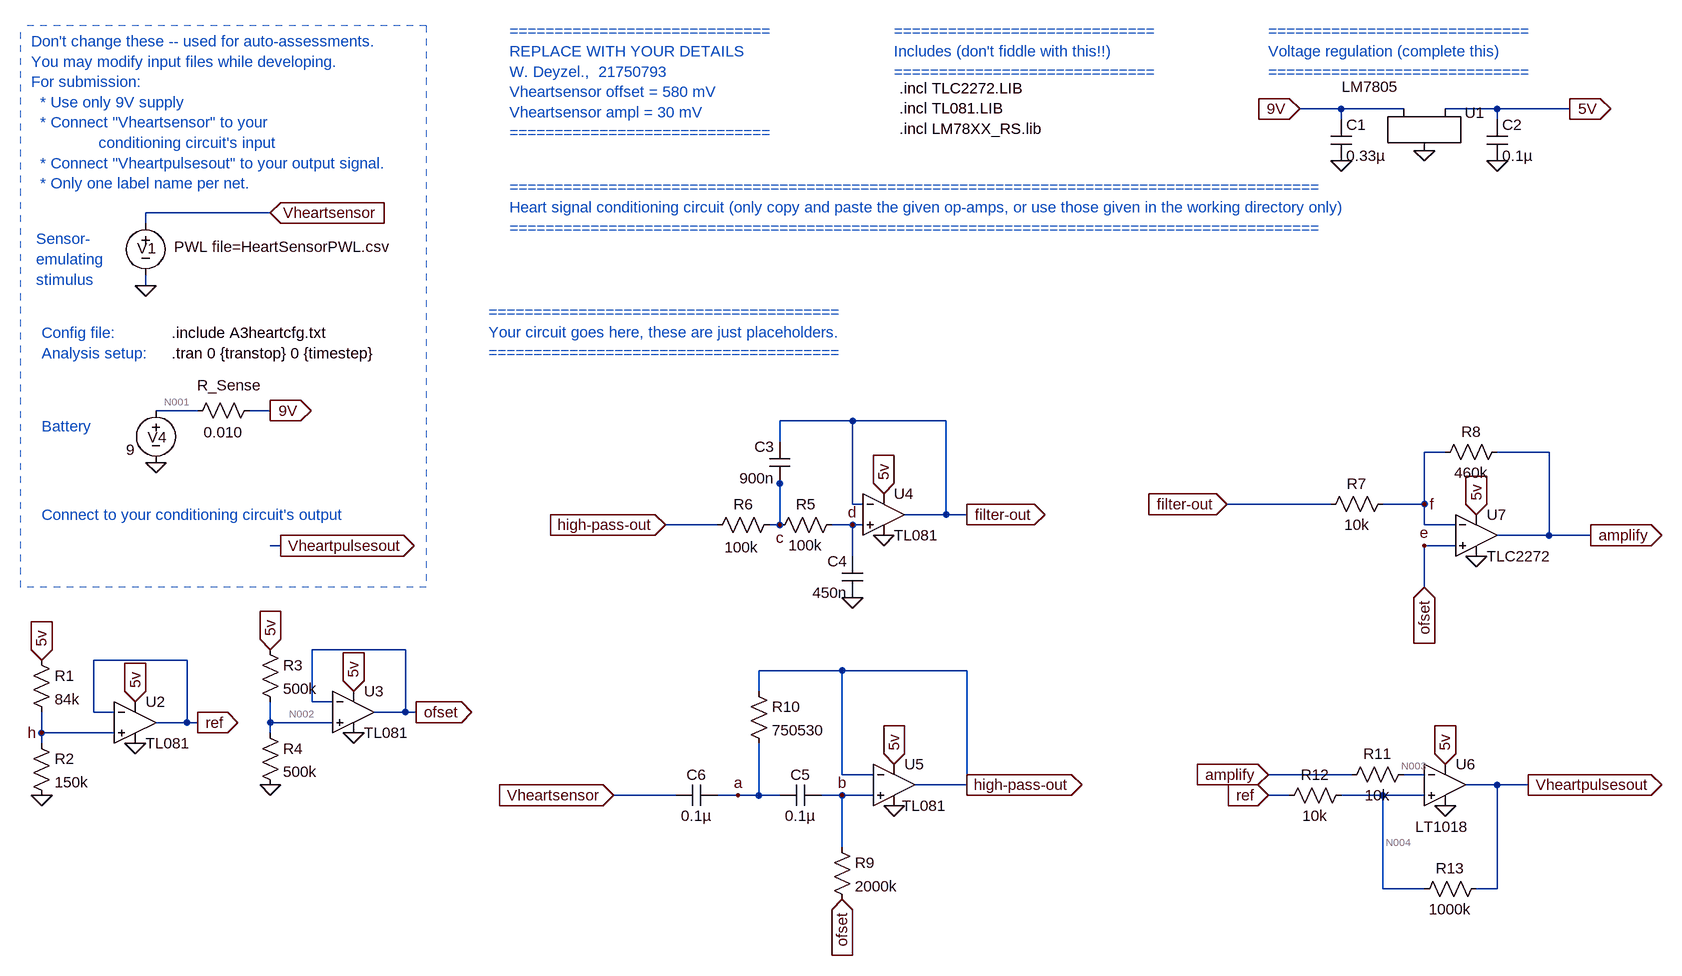
[diagram p0: schematic E344_A3_heart.asc]
E344_A3_heart.asc, the LTspice schematic file:
Version 4
SHEET 1 1824 680
WIRE -272 -1280 -336 -1280
WIRE -176 -1280 -272 -1280
WIRE -32 -1280 -112 -1280
WIRE 80 -1280 -32 -1280
WIRE -272 -1264 -272 -1280
WIRE -32 -1264 -32 -1280
WIRE -1920 -1120 -2112 -1120
WIRE -2112 -1104 -2112 -1120
WIRE -2112 -1008 -2112 -1024
WIRE -2032 -816 -2096 -816
WIRE -1920 -816 -1952 -816
WIRE -1024 -800 -1136 -800
WIRE -880 -800 -1024 -800
WIRE -1136 -768 -1136 -800
WIRE -112 -752 -144 -752
WIRE 48 -752 -32 -752
WIRE -1136 -704 -1136 -720
WIRE -1024 -672 -1024 -800
WIRE -1008 -672 -1024 -672
WIRE -288 -672 -448 -672
WIRE -144 -672 -144 -752
WIRE -144 -672 -208 -672
WIRE -880 -656 -880 -800
WIRE -880 -656 -944 -656
WIRE -848 -656 -880 -656
WIRE -1232 -640 -1312 -640
WIRE -1136 -640 -1136 -704
WIRE -1136 -640 -1152 -640
WIRE -1024 -640 -1056 -640
WIRE -1008 -640 -1024 -640
WIRE -144 -640 -144 -672
WIRE -96 -640 -144 -640
WIRE 48 -624 48 -752
WIRE 48 -624 -32 -624
WIRE 112 -624 48 -624
WIRE -1904 -608 -1920 -608
WIRE -96 -608 -144 -608
WIRE -1024 -592 -1024 -640
WIRE -144 -544 -144 -608
WIRE -1712 -448 -1856 -448
WIRE -2048 -432 -2192 -432
WIRE -1040 -416 -1168 -416
WIRE -848 -416 -1040 -416
WIRE -1168 -384 -1168 -416
WIRE -1856 -368 -1856 -448
WIRE -1824 -368 -1856 -368
WIRE -2192 -352 -2192 -432
WIRE -2160 -352 -2192 -352
WIRE -1712 -352 -1712 -448
WIRE -1712 -352 -1760 -352
WIRE -1696 -352 -1712 -352
WIRE -2048 -336 -2048 -432
WIRE -2048 -336 -2096 -336
WIRE -2032 -336 -2048 -336
WIRE -1920 -336 -1920 -368
WIRE -1824 -336 -1920 -336
WIRE -2272 -320 -2272 -352
WIRE -2160 -320 -2272 -320
WIRE -1920 -320 -1920 -336
WIRE -2272 -304 -2272 -320
WIRE -1040 -256 -1040 -416
WIRE -992 -256 -1040 -256
WIRE -256 -256 -384 -256
WIRE -144 -256 -176 -256
WIRE -848 -240 -848 -416
WIRE -848 -240 -928 -240
WIRE -32 -240 -80 -240
WIRE 16 -240 -32 -240
WIRE -1296 -224 -1392 -224
WIRE -1200 -224 -1232 -224
WIRE -1168 -224 -1168 -304
WIRE -1168 -224 -1200 -224
WIRE -1136 -224 -1168 -224
WIRE -1040 -224 -1072 -224
WIRE -992 -224 -1040 -224
WIRE -352 -224 -384 -224
WIRE -208 -224 -272 -224
WIRE -144 -224 -208 -224
WIRE -1040 -144 -1040 -224
WIRE -208 -80 -208 -224
WIRE -144 -80 -208 -80
WIRE -32 -80 -32 -240
WIRE -32 -80 -64 -80
FLAG -2112 -1008 0
FLAG -1920 -1120 Vheartsensor
IOPIN -1920 -1120 In
FLAG -1920 -816 9V
IOPIN -1920 -816 Out
FLAG -2096 -736 0
FLAG -336 -1280 9V
IOPIN -336 -1280 In
FLAG -144 -1216 0
FLAG 80 -1280 5V
IOPIN 80 -1280 Out
FLAG -1904 -608 Vheartpulsesout
IOPIN -1904 -608 Out
FLAG -1392 -224 Vheartsensor
IOPIN -1392 -224 In
FLAG 16 -240 Vheartpulsesout
IOPIN 16 -240 Out
FLAG -272 -1200 0
FLAG -32 -1200 0
FLAG -2272 -432 5v
IOPIN -2272 -432 In
FLAG -2272 -224 0
FLAG -2032 -336 ref
IOPIN -2032 -336 Out
FLAG -2128 -304 0
FLAG -2128 -368 5v
IOPIN -2128 -368 In
FLAG -2272 -320 h
FLAG -1920 -448 5v
IOPIN -1920 -448 In
FLAG -1920 -240 0
FLAG -1696 -352 ofset
IOPIN -1696 -352 Out
FLAG -1792 -320 0
FLAG -1792 -384 5v
IOPIN -1792 -384 In
FLAG -976 -624 0
FLAG -976 -688 5v
IOPIN -976 -688 In
FLAG -1024 -528 0
FLAG -448 -672 filter-out
IOPIN -448 -672 In
FLAG -64 -592 0
FLAG -64 -656 5v
IOPIN -64 -656 In
FLAG -848 -656 filter-out
IOPIN -848 -656 Out
FLAG -960 -272 5v
IOPIN -960 -272 In
FLAG -960 -208 0
FLAG -848 -240 high-pass-out
IOPIN -848 -240 Out
FLAG -1312 -640 high-pass-out
IOPIN -1312 -640 In
FLAG -1040 -64 ofset
IOPIN -1040 -64 In
FLAG -144 -544 ofset
IOPIN -144 -544 In
FLAG 112 -624 amplify
IOPIN 112 -624 Out
FLAG -1200 -224 a
FLAG -1040 -224 b
FLAG -1136 -640 c
FLAG -1024 -640 d
FLAG -144 -608 e
FLAG -144 -672 f
FLAG -112 -208 0
FLAG -112 -272 5v
IOPIN -112 -272 In
FLAG -384 -256 amplify
IOPIN -384 -256 In
FLAG -384 -224 ref
IOPIN -384 -224 In
SYMBOL voltage -2112 -1120 R0
WINDOW 123 0 0 Left 0
WINDOW 39 0 0 Left 0
WINDOW 3 44 52 Left 2
WINDOW 0 -13 54 Left 2
SYMATTR Value PWL file=HeartSensorPWL.csv
SYMATTR InstName V1
SYMBOL voltage -2096 -832 R0
WINDOW 123 24 44 Left 2
WINDOW 39 0 0 Left 0
WINDOW 3 -46 76 Left 2
WINDOW 0 -13 57 Left 2
SYMATTR Value 9
SYMATTR InstName V4
SYMBOL res -1936 -832 R90
WINDOW 0 -7 47 VBottom 2
WINDOW 3 34 56 VTop 2
SYMATTR InstName R_Sense
SYMATTR Value 0.010
SYMBOL LM7805 -144 -1264 R0
WINDOW 3 -83 -66 Top 2
SYMATTR InstName U1
SYMBOL cap -288 -1264 R0
SYMATTR InstName C1
SYMATTR Value 0.33µ
SYMBOL cap -48 -1264 R0
SYMATTR InstName C2
SYMATTR Value 0.1µ
SYMBOL res -2288 -448 R0
SYMATTR InstName R1
SYMATTR Value 84k
SYMBOL res -2288 -320 R0
SYMATTR InstName R2
SYMATTR Value 150k
SYMBOL Opamps\\opamp2 -2128 -400 R0
SYMATTR InstName U2
SYMATTR Value TL081
SYMBOL res -1936 -464 R0
SYMATTR InstName R3
SYMATTR Value 500k
SYMBOL res -1936 -336 R0
SYMATTR InstName R4
SYMATTR Value 500k
SYMBOL Opamps\\opamp2 -1792 -416 R0
SYMATTR InstName U3
SYMATTR Value TL081
SYMBOL res -1040 -656 R90
WINDOW 0 0 56 VBottom 2
WINDOW 3 32 56 VTop 2
SYMATTR InstName R5
SYMATTR Value 100k
SYMBOL res -1136 -656 R90
WINDOW 0 0 56 VBottom 2
WINDOW 3 35 59 VTop 2
SYMATTR InstName R6
SYMATTR Value 100k
SYMBOL cap -1120 -704 R180
WINDOW 0 24 56 Left 2
WINDOW 3 24 8 Left 2
SYMATTR InstName C3
SYMATTR Value 900n
SYMBOL cap -1008 -528 R180
WINDOW 0 24 56 Left 2
WINDOW 3 24 8 Left 2
SYMATTR InstName C4
SYMATTR Value 450n
SYMBOL Opamps\\opamp2 -976 -720 R0
SYMATTR InstName U4
SYMATTR Value TL081
SYMBOL res -192 -688 R90
WINDOW 0 0 56 VBottom 2
WINDOW 3 32 56 VTop 2
SYMATTR InstName R7
SYMATTR Value 10k
SYMBOL res -16 -768 R90
WINDOW 0 0 56 VBottom 2
WINDOW 3 32 56 VTop 2
SYMATTR InstName R8
SYMATTR Value 460k
SYMBOL Opamps\\opamp2 -960 -304 R0
WINDOW 3 12 96 Left 2
SYMATTR Value TL081
SYMATTR InstName U5
SYMBOL res -1056 -160 R0
SYMATTR InstName R9
SYMATTR Value 2000k
SYMBOL res -1184 -400 R0
SYMATTR InstName R10
SYMATTR Value 750530
SYMBOL cap -1072 -240 R90
WINDOW 0 0 32 VBottom 2
WINDOW 3 32 32 VTop 2
SYMATTR InstName C5
SYMATTR Value 0.1µ
SYMBOL cap -1232 -240 R90
WINDOW 0 0 32 VBottom 2
WINDOW 3 32 32 VTop 2
SYMATTR InstName C6
SYMATTR Value 0.1µ
SYMBOL res -160 -272 R90
WINDOW 0 0 56 VBottom 2
WINDOW 3 32 56 VTop 2
SYMATTR InstName R11
SYMATTR Value 10k
SYMBOL res -256 -240 R90
WINDOW 0 0 56 VBottom 2
WINDOW 3 32 56 VTop 2
SYMATTR InstName R12
SYMATTR Value 10k
SYMBOL res -48 -96 R90
WINDOW 0 0 56 VBottom 2
WINDOW 3 32 56 VTop 2
SYMATTR InstName R13
SYMATTR Value 1000k
SYMBOL Comparators\\LT1018 -112 -240 R0
WINDOW 3 -46 64 Left 2
SYMATTR InstName U6
SYMBOL Opamps\\opamp2 -64 -688 R0
SYMATTR InstName U7
SYMATTR Value TLC2272
TEXT -2072 -904 Left 2 !.tran 0 {transtop} 0 {timestep}
TEXT -2072 -936 Left 2 !.include A3heartcfg.txt
TEXT -2288 -1384 Left 2 ;Don't change these -- used for auto-assessments.\nYou may modify input files while developing.\nFor submission: \n  * Use only 9V supply \n  * Connect "Vheartsensor" to your \n               conditioning circuit's input\n  * Connect "Vheartpulsesout" to your output signal.\n  * Only one label name per net.
TEXT -2272 -936 Left 2 ;Config file:
TEXT -2272 -904 Left 2 ;Analysis setup:
TEXT -2272 -792 Left 2 ;Battery
TEXT -2280 -1080 Left 2 ;Sensor-\nemulating \nstimulus
TEXT -1552 -1400 Left 2 ;=============================\nREPLACE WITH YOUR DETAILS\nW. Deyzel.,  21750793\nVheartsensor offset = 580 mV\nVheartsensor ampl = 30 mV\n=============================
TEXT -1552 -1160 Left 2 ;==========================================================================================\nHeart signal conditioning circuit (only copy and paste the given op-amps, or use those given in the working directory only)\n==========================================================================================
TEXT -384 -1400 Left 2 ;=============================\nVoltage regulation (complete this)\n=============================
TEXT -952 -1312 Left 2 !.incl TLC2272.LIB\n.incl TL081.LIB\n.incl LM78XX_RS.lib
TEXT -2272 -656 Left 2 ;Connect to your conditioning circuit's output
TEXT -960 -1400 Left 2 ;=============================\nIncludes (don't fiddle with this!!)\n=============================
TEXT -1584 -968 Left 2 ;=======================================\nYour circuit goes here, these are just placeholders.\n=======================================
LINE Normal -2304 -544 -2304 -1408 1
LINE Normal -1680 -1408 -1680 -544 1
LINE Normal -1680 -544 -2304 -544 1
LINE Normal -1680 -1408 -2304 -1408 1

The netlist it stands for:
* E344_A3_heart.asc
V1 Vheartsensor 0 PWL file=HeartSensorPWL.csv
V4 N001 0 9
R_Sense 9V N001 0.010
XU1 9V 0 5V LM7805
C1 9V 0 0.33µ
C2 5V 0 0.1µ
R1 5V h 84k
R2 h 0 150k
XU2 h ref 5V 0 ref TL081  ; pins In+ In- V+ V- OUT
R3 5V N002 500k
R4 N002 0 500k
XU3 N002 e 5V 0 e TL081  ; pins In+ In- V+ V- OUT
R5 d c 100k
R6 c high-pass-out 100k
C3 c filter-out 900n
C4 0 d 450n
XU4 d filter-out 5V 0 filter-out TL081  ; pins In+ In- V+ V- OUT
R7 f filter-out 10k
R8 amplify f 460k
XU5 b high-pass-out 5V 0 high-pass-out TL081  ; pins In+ In- V+ V- OUT
R9 b e 2000k
R10 high-pass-out a 750530
C5 b a 0.1µ
C6 a Vheartsensor 0.1µ
R11 N003 amplify 10k
R12 N004 ref 10k
R13 Vheartpulsesout N004 1000k
XU6 N004 N003 5V 0 Vheartpulsesout LT1018  ; pins In+ In- V+ V- OUT
XU7 e f 5V 0 amplify TLC2272  ; pins In+ In- V+ V- OUT
.tran 0 {transtop} 0 {timestep}
.include A3heartcfg.txt
* Don't change these -- used for auto-assessments.
* You may modify input files while developing.
* For submission:
*   * Use only 9V supply
*   * Connect "Vheartsensor" to your
*                conditioning circuit's input
*   * Connect "Vheartpulsesout" to your output signal.
*   * Only one label name per net.
* Config file:
* Analysis setup:
* Battery
* Sensor-
* emulating
* stimulus
* =============================
* REPLACE WITH YOUR DETAILS
* W. Deyzel.,  21750793
* Vheartsensor offset = 580 mV
* Vheartsensor ampl = 30 mV
* =============================
* ==========================================================================================
* Heart signal conditioning circuit (only copy and paste the given op-amps, or use those given in the working directory only)
* ==========================================================================================
* =============================
* Voltage regulation (complete this)
* =============================
.incl TLC2272.LIB
.incl TL081.LIB
.incl LM78XX_RS.lib
* Connect to your conditioning circuit's output
* =============================
* Includes (don't fiddle with this!!)
* =============================
* =======================================
* Your circuit goes here, these are just placeholders.
* =======================================
.lib LTC1.lib
.backanno
.end

* Results of the author's LTspice run, read from the files saved beside the schematic
* Operating Point, zero values left out:
*   V(vheartsensor) = 1.891 V
*   V(n001) = 9 V
*   V(9v) = 9 V
*   V(5v) = 5.003 V
*   V(h) = 3.207 V
*   V(ref) = 3.207 V
*   V(n002) = 2.501 V
*   V(e) = 2.501 V
*   V(d) = 2.501 V
*   V(c) = 2.501 V
*   V(high-pass-out) = 2.501 V
*   V(filter-out) = 2.501 V
*   V(f) = 2.502 V
*   V(amplify) = 2.524 V
*   V(b) = 2.501 V
*   V(a) = 2.501 V
*   V(n003) = 2.524 V
*   V(n004) = 3.224 V
*   V(vheartpulsesout) = 4.962 V
*   I(R13) = 1.737 µA
*   I(R12) = 1.731 µA
*   I(R11) = -100 pA
*   I(R9) = -32.55 pA
*   I(R8) = 48.12 nA
*   I(R7) = 48.11 nA
*   I(R6) = -32.55 pA
*   I(R5) = -32.55 pA
*   I(R4) = 5.003 µA
*   I(R3) = 5.003 µA
*   I(R2) = 21.38 µA
*   I(R1) = 21.38 µA
*   I(R_sense) = -17.74 mA
*   I(V4) = -17.74 mA
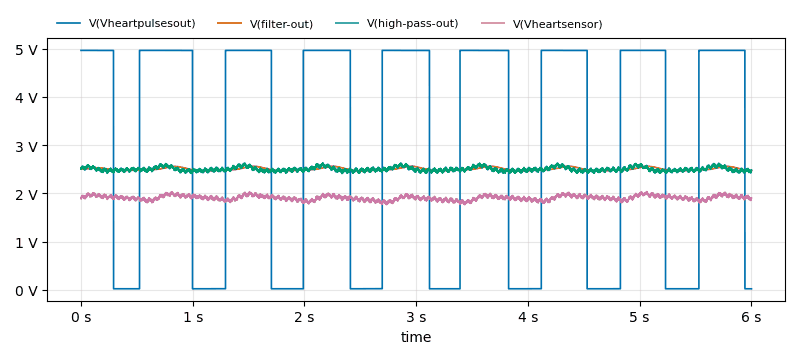
[diagram p1: Transient Analysis of E344_A3_heart.asc, plotted from the saved traces]
* Transient Analysis, 1 run:
*   V(Vheartpulsesout): min 22.07 mV, max 4.962 V, average 3.05 V, rms 3.885 V, last 22.29 mV
*   V(filter-out): min 2.464 V, max 2.561 V, average 2.502 V, rms 2.502 V, last 2.47 V
*   V(high-pass-out): min 2.409 V, max 2.634 V, average 2.501 V, rms 2.502 V, last 2.48 V
*   V(Vheartsensor): min 1.762 V, max 2.036 V, average 1.907 V, rms 1.908 V, last 1.908 V